# Altium schematic sheet OMD_TOF.SchDoc
size A4; Organization: Altium Limited; Address1: L3, 12a Rodborough Rd; Address2: Frenchs Forest; Address3: NSW; Address4: Australia 2086
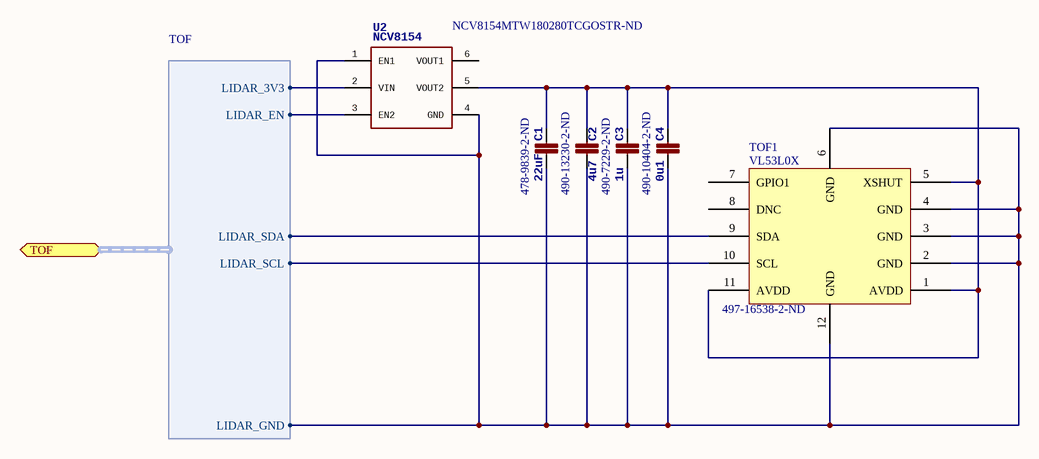
[diagram p0: OMD_TOF.SchDoc]

## Parts
C1  22uF  Supplier Part Number 1: 478-9839-2-ND  [0201-cap]
C2  4u7  Supplier Part Number 1: 490-13230-2-ND  [0201-cap]
C3  1u  Supplier Part Number 1: 490-7229-2-ND  [0201-cap]
C4  0u1  Supplier Part Number 1: 490-10404-2-ND  [0201-cap]
TOF1  VL53L0X  Supplier Part Number 1: 497-16538-2-ND  [VL53L0X]
U2  NCV8154  Supplier Part Number 1: NCV8154MTW180280TCGOSTR-ND  [NCV8154]

## Ports
TOF (harness TOF)

## Harnesses
TOF: LIDAR_3V3, LIDAR_SDA, LIDAR_SCL, LIDAR_GND, LIDAR_EN

## Nets
NetC1_1: C1.1 C2.1 C3.1 C4.1 TOF1.1(AVDD) TOF1.5(XSHUT) TOF1.11(AVDD) U2.5(VOUT2)
NetC1_2: C1.2 C2.2 C3.2 C4.2 TOF1.2(GND) TOF1.3(GND) TOF1.4(GND) TOF1.6(GND) TOF1.12(GND) U2.1(EN1) U2.4(GND) ; port TOF.LIDAR_GND
NetTOF1_9: TOF1.9(SDA) ; port TOF.LIDAR_SDA
NetTOF1_10: TOF1.10(SCL) ; port TOF.LIDAR_SCL
NetU2_2: U2.2(VIN) ; port TOF.LIDAR_3V3
NetU2_3: U2.3(EN2) ; port TOF.LIDAR_EN

Not connected (* = marked no-connect by the designer): TOF1 7(GPIO1) 8(DNC); U2 6(VOUT1)

## Notes on the sheet
- https://github.com/OpenMotorDrive
- https://creativecommons.org/licenses/by-nc-sa/4.0/
- For Commercial use, please contact ProfiCNC
- Title
- Size:
- Date:
- A4
- Number:
- Time:
- Revision:
- Sheet
- of
- ProfiCNC Pty. Ltd.
- ProfiCNC does NOT guaranty these drawings as fit for any purpose, you must verify this information before attempting to use it in any way.  USE AT OWN RISK
- File:

## Library data of the parts
C1 = CAP0805: CAP CER 22UF 6.3V X5R 0402; Supplier 1: Digi-Key
C2 = CAP0603: CAP CER 4.7UF 6.3V X5R 0201; Supplier 1: Digi-Key
C3 = CAP0603: CAP CER 1UF 6.3V X5R 0201; Supplier 1: Digi-Key
C4 = CAP0402: CAP CER 0.1UF 16V Y5V 0402; Supplier 1: Digi-Key
U2 = NCV8154: IC REG LDO 1.8v and 2.8v; Supplier 1: Digi-Key
TOF1 = VL53L0X: Supplier 1: Digi-Key